# EAGLE design W5500_Tessel_mikroBUS_Click_005 (EAGLE 6.5.0)
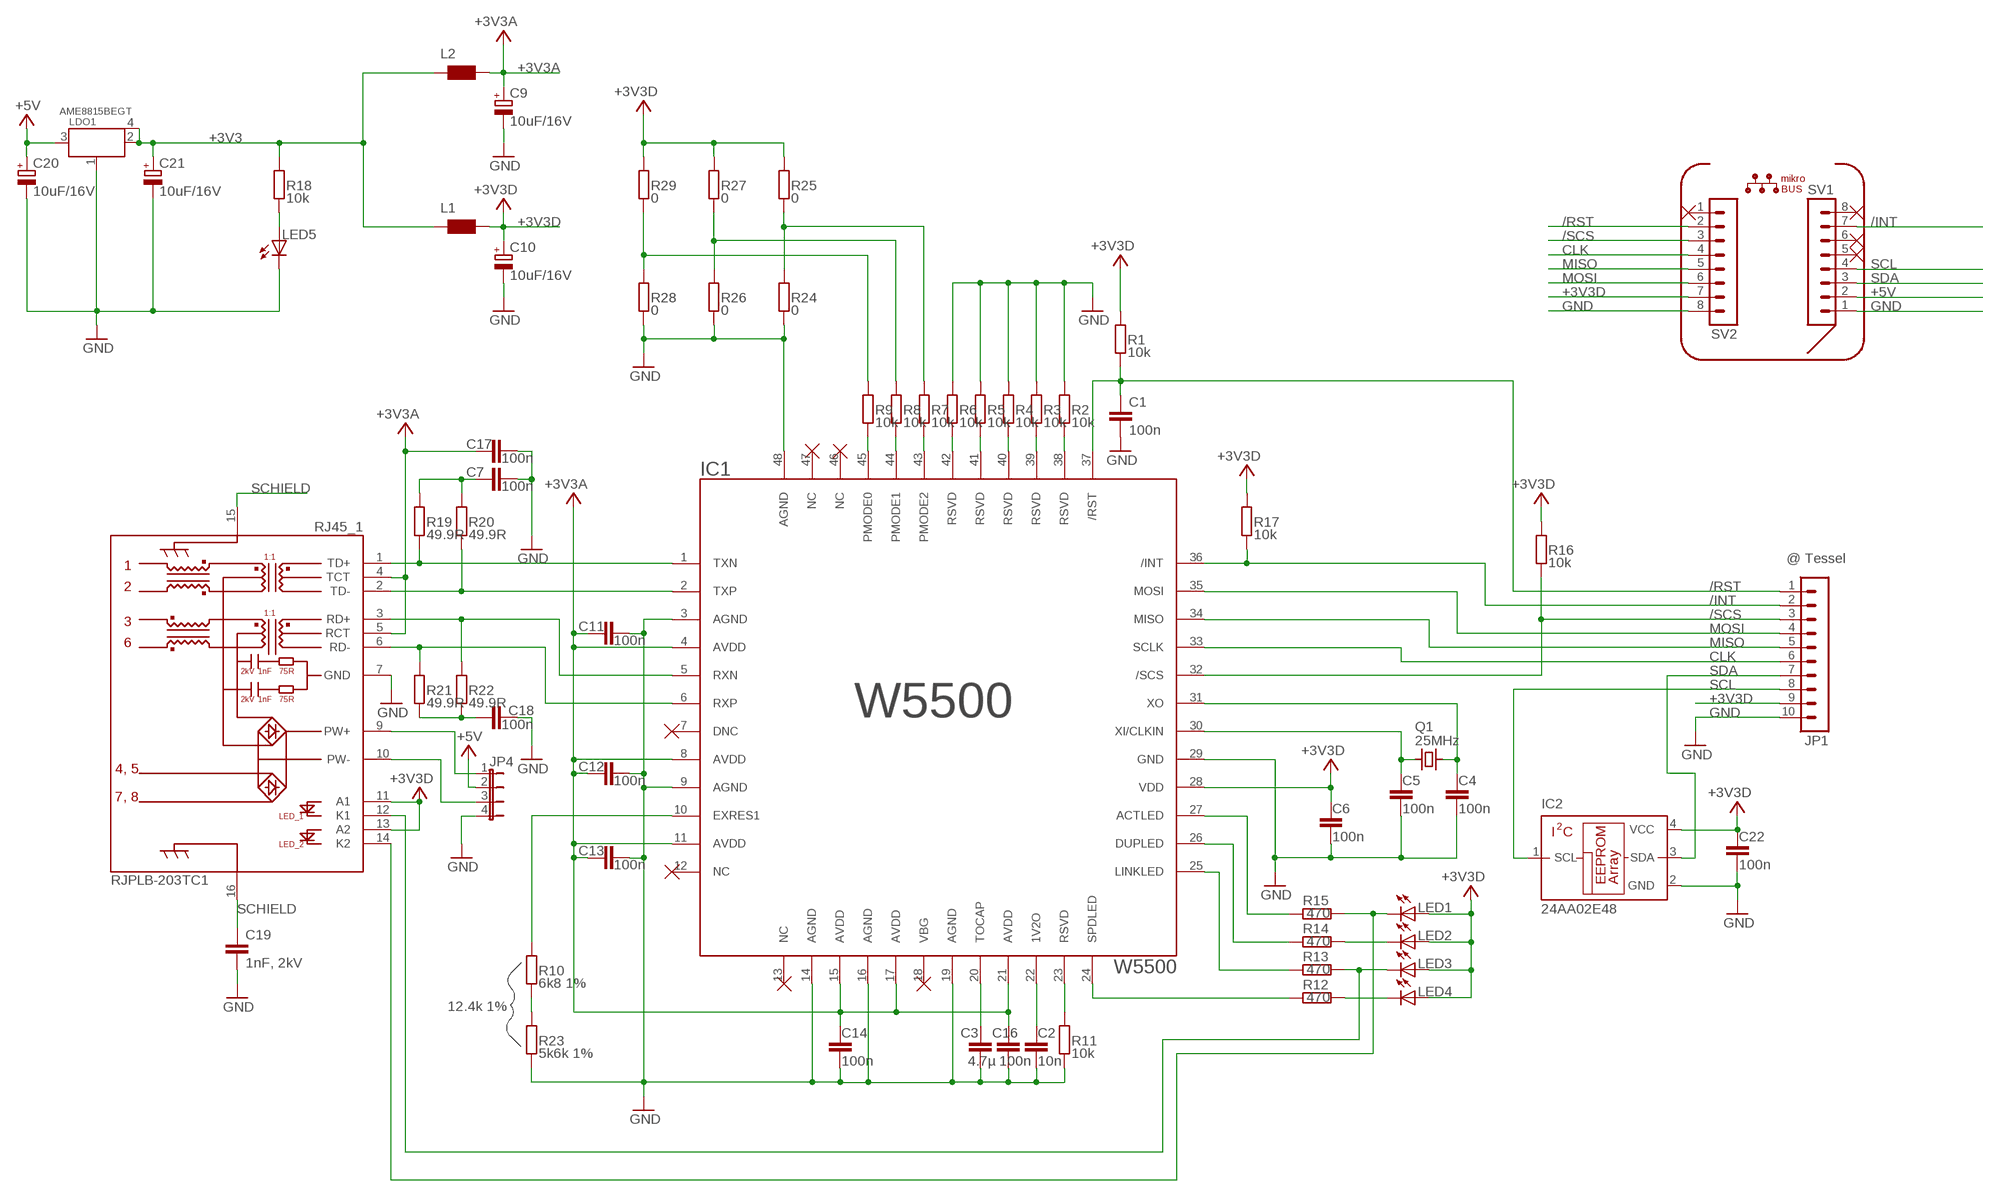
[diagram p0: schematic, sheet 1]

## Parts
C1  100n  C-EUC0603K  [C0603K]
C2  10n  C-EUC0402K  [C0402K]
C3  4.7µ  C-EUC0603K  [C0603K]
C4  100n  C-EUC0402K  [C0402K]
C5  100n  C-EUC0402K  [C0402K]
C6  100n  C-EUC0402K  [C0402K]
C7  100n  C-EUC0402K  [C0402K]
C9  10uF/16V  CPOL-EUA/3216-18R  [A/3216-18R]
C10  10uF/16V  CPOL-EUA/3216-18R  [A/3216-18R]
C11  100n  C-EUC0402K  [C0402K]
C12  100n  C-EUC0402K  [C0402K]
C13  100n  C-EUC0402K  [C0402K]
C14  100n  C-EUC0402K  [C0402K]
C16  100n  C-EUC0402K  [C0402K]
C17  100n  C-EUC0402K  [C0402K]
C18  100n  C-EUC0402K  [C0402K]
C19  1nF, 2kV  C-EUC3216  [C3216]
C20  10uF/16V  CPOL-EUA/3216-18R  [A/3216-18R]
C21  10uF/16V  CPOL-EUA/3216-18R  [A/3216-18R]
C22  100n  C-EUC0402K  [C0402K]
IC1  W5500  [LQFP48]
IC2  24AA02E48  24AA00OT  [SOT23-5L]
JP1  @ Tessel  MA10-1  [MA10-1]
JP4  JP4E  [JP4]
L1  WE-CBF_0603  [0603]
L2  WE-CBF_0603  [0603]
LDO1  AME8815BEGT  [SOT223]
LED1  LEDCHIPLED_0603  [CHIPLED_0603]
LED2  LEDCHIPLED_0603  [CHIPLED_0603]
LED3  LEDCHIPLED_0603  [CHIPLED_0603]
LED4  LEDCHIPLED_0603  [CHIPLED_0603]
LED5  LEDCHIPLED_0603  [CHIPLED_0603]
Q1  25MHz  SMD02502-4  [SMD02502-4]
R1  10k  R-EU_R0402  [R0402]
R2  10k  R-EU_R0402  [R0402]
R3  10k  R-EU_R0402  [R0402]
R4  10k  R-EU_R0402  [R0402]
R5  10k  R-EU_R0402  [R0402]
R6  10k  R-EU_R0402  [R0402]
R7  10k  R-EU_R0402  [R0402]
R8  10k  R-EU_R0402  [R0402]
R9  10k  R-EU_R0402  [R0402]
R10  6k8 1%  R-EU_R0402  [R0402]
R11  10k  R-EU_R0402  [R0402]
R12  470  R-EU_R0402  [R0402]
R13  470  R-EU_R0402  [R0402]
R14  470  R-EU_R0402  [R0402]
R15  470  R-EU_R0402  [R0402]
R16  10k  R-EU_R0402  [R0402]
R17  10k  R-EU_R0402  [R0402]
R18  10k  R-EU_R0402  [R0402]
R19  49.9R  R-EU_R0402  [R0402]
R20  49.9R  R-EU_R0402  [R0402]
R21  49.9R  R-EU_R0402  [R0402]
R22  49.9R  R-EU_R0402  [R0402]
R23  5k6k 1%  R-EU_R0402  [R0402]
R24  0  R-EU_R0402  [R0402]
R25  0  R-EU_R0402  [R0402]
R26  0  R-EU_R0402  [R0402]
R27  0  R-EU_R0402  [R0402]
R28  0  R-EU_R0402  [R0402]
R29  0  R-EU_R0402  [R0402]
RJ45_1  RJPLB-203TC1  [RJPLB-203]
SV1  MA08-1  [MA08-1]
SV2  MA08-1  [MA08-1]

## Nets
+3V3: C21.+ L1.2 L2.2 LDO1.2 LDO1.4 R18.2
+3V3A: C9.+ C11.1 C12.1 C13.1 C14.1 C16.1 C17.1 IC1.4(AVDD) IC1.8(AVDD) IC1.11(AVDD) IC1.15(AVDD) IC1.17(AVDD) IC1.21(AVDD) L2.1 RJ45_1.4(TCT) RJ45_1.5(RCT)
+3V3D: C6.1 C10.+ C22.1 IC1.28(VDD) IC2.4(VCC) JP1.9 L1.1 LED1.A LED2.A LED3.A LED4.A R1.2 R16.2 R17.2 R25.2 R27.2 R29.2 RJ45_1.11(A1) RJ45_1.13(A2) SV2.7
+5V: C20.+ JP4.2 LDO1.3 SV1.2
/INT: IC1.36(/INT) JP1.2 R17.1 SV1.7
/RST: C1.1 IC1.37(/RST) JP1.1 R1.1 SV2.2
/SCS: IC1.32(/SCS) JP1.3 R16.1 SV2.3
ACTLED: IC1.27(ACTLED) R15.1
CLK: IC1.33(SCLK) JP1.6 SV2.4
GND: C1.2 C2.2 C3.2 C4.2 C5.2 C6.2 C7.2 C9.- C10.- C11.2 C12.2 C13.2 C14.2 C16.2 C17.2 C18.2 C19.2 C20.- C21.- C22.2 IC1.3(AGND) IC1.9(AGND) IC1.14(AGND) IC1.16(AGND) IC1.19(AGND) IC1.29(GND) IC1.48(AGND) IC2.2(GND) JP1.10 JP4.4 LDO1.1 LED5.C R2.2 R3.2 R4.2 R5.2 R6.2 R11.1 R23.1 R24.1 R26.1 R28.1 RJ45_1.7(GND) SV1.1 SV2.8
MISO: IC1.34(MISO) JP1.5 SV2.5
MOSI: IC1.35(MOSI) JP1.4 SV2.6
N$4: IC1.25(LINKLED) R13.1
N$5: R10.1 R23.2
N$9: IC1.23(RSVD) R11.2
N$10: IC1.38(RSVD) R2.1
N$11: IC1.39(RSVD) R3.1
N$12: IC1.40(RSVD) R4.1
N$13: IC1.41(RSVD) R5.1
N$14: IC1.42(RSVD) R6.1
N$15: IC1.43(PMODE2) R7.1
N$16: IC1.44(PMODE1) R8.1
N$17: IC1.45(PMODE0) R9.1
N$18: R9.2 R28.2 R29.1
N$19: R8.2 R26.2 R27.1
N$20: R7.2 R24.2 R25.1
N$22: IC1.10(EXRES1) R10.2
N$23: C2.1 IC1.22(1V2O)
N$24: C3.1 IC1.20(TOCAP)
N$25: IC1.24(SPDLED) R12.1
N$26: IC1.26(DUPLED) R14.1
N$28: LED4.C R12.2
N$29: LED3.C R13.2 RJ45_1.12(K1)
N$30: LED2.C R14.2
N$31: LED1.C R15.2 RJ45_1.14(K2)
N$32: C4.1 IC1.31(XO) Q1.3
N$33: C5.1 IC1.30(XI/CLKIN) Q1.1
N$34: LED5.A R18.1
N$35: C7.1 R19.2 R20.2
N$36: C18.1 R21.1 R22.1
POE+: JP4.1 RJ45_1.9(PW+)
POE-: JP4.3 RJ45_1.10(PW-)
RXN: IC1.6(RXP) R21.2 RJ45_1.6(RD-)
RXP: IC1.5(RXN) R22.2 RJ45_1.3(RD+)
SCHIELD: C19.1 RJ45_1.15(SCHIELD_1) RJ45_1.16(SCHIELD_2)
SCL: IC2.1(SCL) JP1.8 SV1.4
SDA: IC2.3(SDA) JP1.7 SV1.3
TXN: IC1.2(TXP) R20.1 RJ45_1.2(TD-)
TXP: IC1.1(TXN) R19.1 RJ45_1.1(TD+)
Unconnected: IC1.7(DNC) IC1.12(NC) IC1.13(NC) IC1.18(VBG) IC1.46(NC) IC1.47(NC) SV1.5 SV1.6 SV1.8 SV2.1

## Notes on the sheet
- mikro
  BUS
- W5500
- 12.4k 1%

## Library data of the parts
C1-C7 C11-C14 C16-C19 C22 = resistor:C-EU: CAPACITOR, European symbol
C9 C10 C20 C21 = resistor:CPOL-EU: POLARIZED CAPACITOR, European symbol
IC1 = _wiznet_2013-08-18:W5500: W5500: WIZnet Hardwired TCP/IP + MAC + PHY - Internet Interface Chip
IC2 = microchip:24*00: Serial EEPROM 128 bit, I2C (AA = 1.8 V/LC = 2.5 V/C = 5.0 V); MF: MICROCHIP; MPN: 24AA00T-I/OTG; OC_FARNELL: 1331264; OC_NEWARK: 89H3038
JP1 = con-lstb:MA10-1: PIN HEADER; OC_FARNELL: unknown; OC_NEWARK: unknown
JP4 = jumper:JP4E: JUMPER
L1 L2 = wuerth-elektronik:WE-CBF: SMD EMI Suppression Ferrite Beads - excellent anti-EMI properties - low DCR - impedances till 3000 ohms - rated current up to 6 A
LDO1 = _wiznet_2013-08-18:AME8815BEGT
LED1-LED5 = led:LED: LED OSRAM: - CHIPLED LG R971, LG N971, LY N971, LG Q971, LY Q971, LO R971, LY R971 LH N974, LH R974 LS Q976, LO Q976, LY Q976 LO Q996 - Hyper CHIPLED LW Q18S LB Q993, LB Q99A, LB R99A - SideLED LS A670, LO A670, LY A670, LG A670, LP A670 LB A673, LV A673, LT A673, LW A673 LH A674 LY A675 LS A676, LA A676, LO A676, LY A676, LW A676 LS A679, LY A679, LG A679 - Hyper Micro SIDELED® LS Y876, LA Y876, LO Y876, LY Y876 LT Y87S - SmartLED LW L88C, LW L88S LB L89C, LB L89S, LG L890 LS L89K, LO L89K, LY L89K LS L896, LA L896, LO L896, LY L896 - TOPLED LS T670, LO T670, LY T670, LG T670, LP T670 LSG T670, LSP T670, LSY T670, LOP T670, LYG T670 LG T671, LOG T671, LSG T671 LB T673, LV T673, LT T673, LW T673 LH T674 LS T676, LA T676, LO T676, LY T676, LB T676, LH T676, LSB T676, LW T676 LB T67C, LV T67C, LT T67C, LS T67K, LO T67K, LY T67K, LW E67C LS E67B, LA E67B, LO E67B, LY E67B, LB E67C, LV E67C, LT E67C LW T67C LS T679, LY T679, LG T679 LS T770, LO T770, LY T770, LG T770, LP T770 LB T773, LV T773, LT T773, LW T773 LH T774 LS E675, LA E675, LY E675, LS T675 LS T776, LA T776, LO T776, LY T776, LB T776 LHGB T686 LT T68C, LB T68C - Hyper Mini TOPLED® LB M676 - Mini TOPLED Santana® LG M470 LS M47K, LO M47K, LY M47K Source: http://www.osram.convergy.de LUXEON: - LUMILED® LXK2-PW12-R00, LXK2-PW12-S00, LXK2-PW14-U00, LXK2-PW14-V00 LXK2-PM12-R00, LXK2-PM12-S00, LXK2-PM14-U00 LXK2-PE12-Q00, LXK2-PE12-R00, LXK2-PE12-S00, LXK2-PE14-T00, LXK2-PE14-U00 LXK2-PB12-K00, LXK2-PB12-L00, LXK2-PB12-M00, LXK2-PB14-N00, LXK2-PB14-P00, LXK2-PB14-Q00 LXK2-PR12-L00, LXK2-PR12-M00, LXK2-PR14-Q00, LXK2-PR14-R00 LXK2-PD12-Q00, LXK2-PD12-R00, LXK2-PD12-S00 LXK2-PH12-R00, LXK2-PH12-S00 LXK2-PL12-P00, LXK2-PL12-Q00, LXK2-PL12-R00 Source: www.luxeon.com KINGBRIGHT: KA-3528ASYC Source: www.kingbright.com
Q1 = Petermann_5_11_0:SMD02502-4
R1-R29 = resistor:R-EU_: RESISTOR, European symbol
RJ45_1 = Taimag:RJPLB-203TC1
SV1 SV2 = con-lstb:MA08-1: PIN HEADER; OC_FARNELL: unknown; OC_NEWARK: unknown

## Board
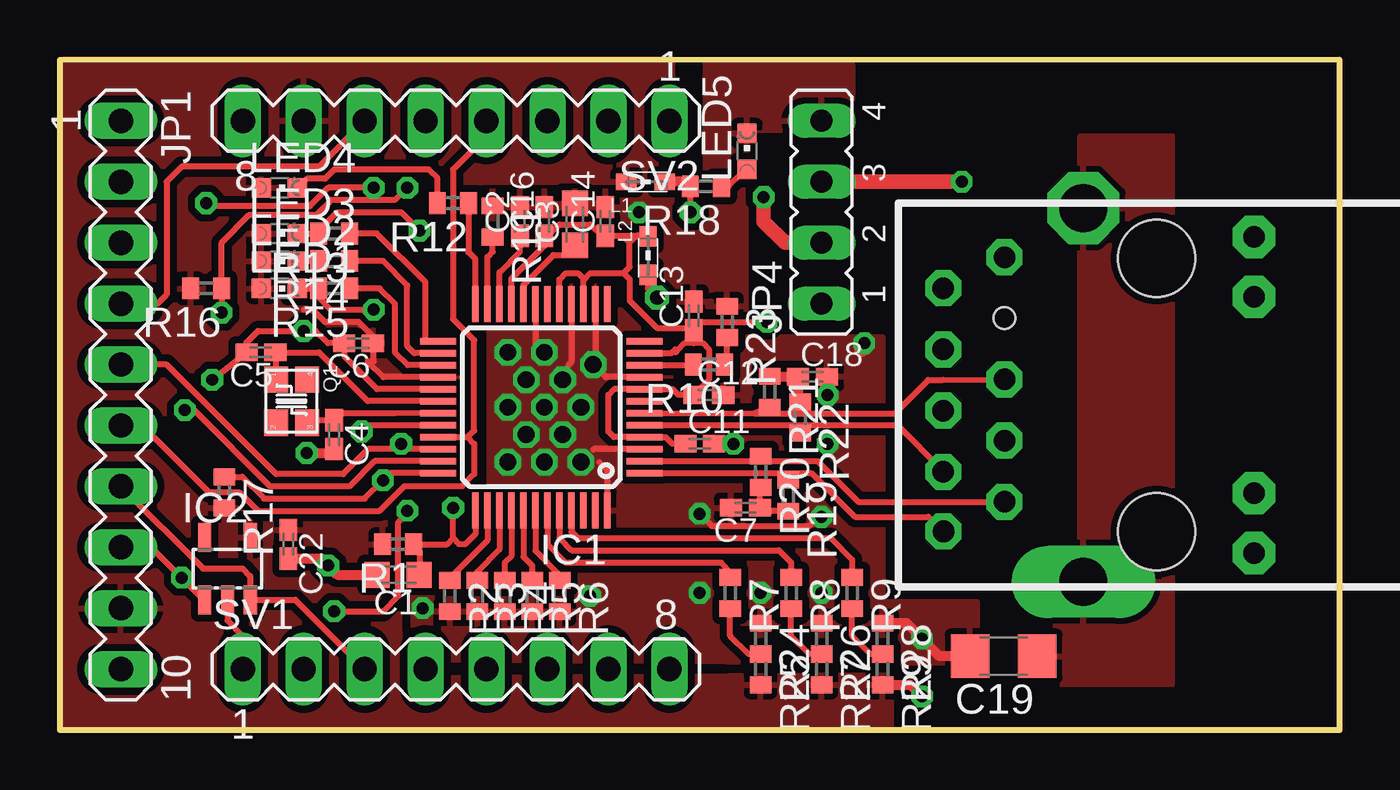
[diagram p1: board, top side]
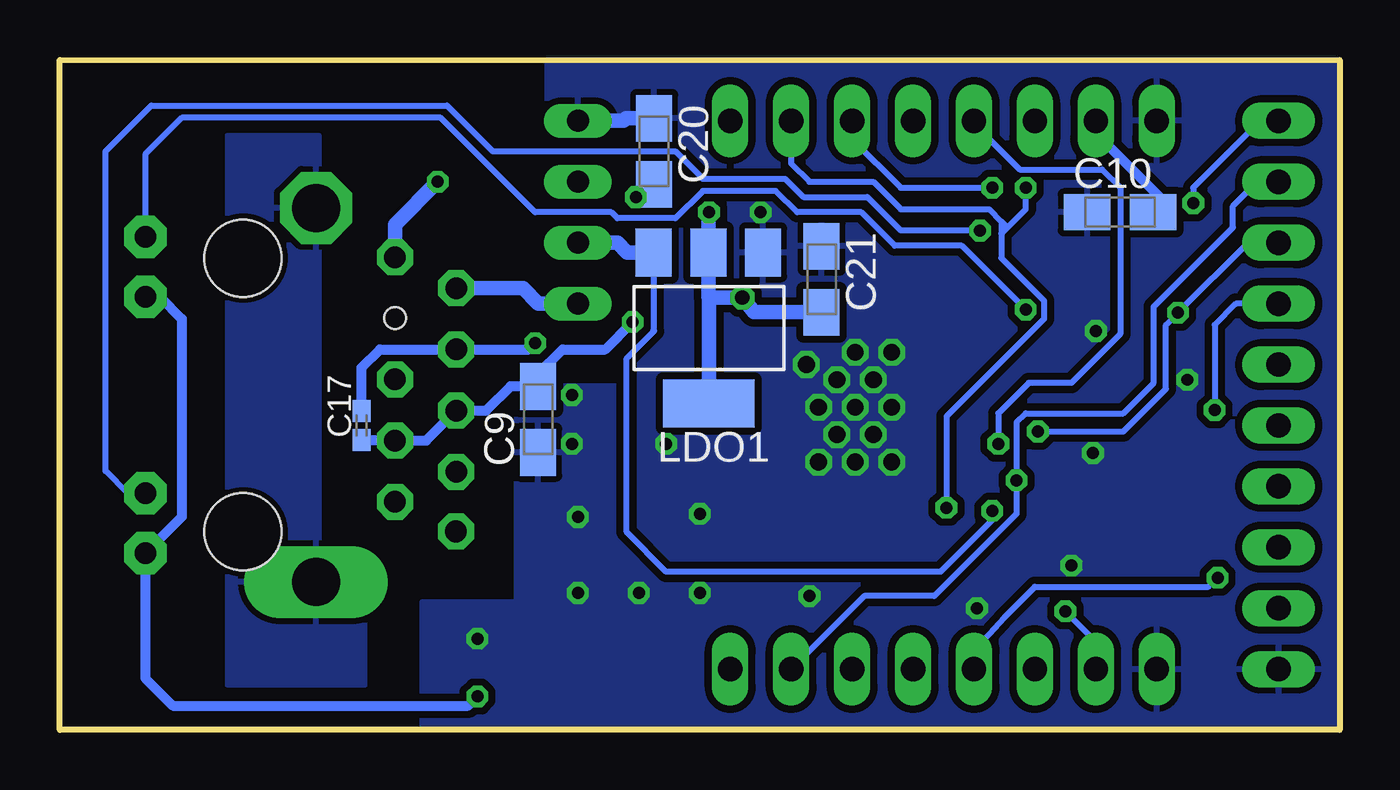
[diagram p2: board, bottom side, seen from below]

Size 53.34 x 27.94 mm. Coordinates in mm from the lower left corner, seen from the top.
Outline: 0,0 53.34,0 53.34,27.94 0,27.93 0,0
Copper layers (1*16): Top 0.035mm / dielectric 1.5mm / Bottom 0.035mm
Design rules "default *": minimum track width 10mil, minimum drill 24mil, track to track 8mil, track to pad 8mil, pad to pad 8mil, via to via 8mil, smd to smd 8mil, copper to edge 0mil, drill to drill 8mil, minimum pad ring 10mil, minimum via ring 8mil, stop-mask expansion 4mil, vias tented up to drill 0mil, thermal gap 10mil

### Footprints (pad centres in the part's own frame; a part is rotated, then mirrored left to right if it is on the bottom)
C0603K = smd 1.05 x 1.08: 1 -0.875,0; 2 0.875,0
C0402K = smd 0.925 x 0.74: 1 -0.6,0; 2 0.6,0
A/3216-18R = smd 1.95 x 1.5: + 1.375,0; - -1.375,0
C3216 = smd 1.6 x 1.8: 1 -1.4,0; 2 1.4,0
LQFP48 = smd 1.5 x 0.28: 1 -4.3,2.75; 2 -4.3,2.25; 3 -4.3,1.75; 4 -4.3,1.25; 5 -4.3,0.75; 6 -4.3,0.25; 7 -4.3,-0.25; 8 -4.3,-0.75; 9 -4.3,-1.25; 10 -4.3,-1.75; 11 -4.3,-2.25; 12 -4.3,-2.75; 25 4.3,-2.75; 26 4.3,-2.25; 27 4.3,-1.75; 28 4.3,-1.25; 29 4.3,-0.75; 30 4.3,-0.25; 31 4.3,0.25; 32 4.3,0.75; 33 4.3,1.25; 34 4.3,1.75; 35 4.3,2.25; 36 4.3,2.75 | smd 0.28 x 1.5: 13 -2.75,-4.3; 14 -2.25,-4.3; 15 -1.75,-4.3; 16 -1.25,-4.3; 17 -0.75,-4.3; 18 -0.25,-4.3; 19 0.25,-4.3; 20 0.75,-4.3; 21 1.25,-4.3; 22 1.75,-4.3; 23 2.25,-4.3; 24 2.75,-4.3; 37 2.75,4.3; 38 2.25,4.3; 39 1.75,4.3; 40 1.25,4.3; 41 0.75,4.3; 42 0.25,4.3; 43 -0.25,4.3; 44 -0.75,4.3; 45 -1.25,4.3; 46 -1.75,4.3; 47 -2.25,4.3; 48 -2.75,4.3
SOT23-5L = smd 0.55 x 1.2: 1 -0.95,-1.3; 2 0,-1.3; 3 0.95,-1.3; 4 0.95,1.3; 5 -0.95,1.3
MA10-1 = drill 1.016 long: 1 -11.43,0; 2 -8.89,0; 3 -6.35,0; 4 -3.81,0; 5 -1.27,0; 6 1.27,0; 7 3.81,0; 8 6.35,0; 9 8.89,0; 10 11.43,0
JP4 = drill 0.914 long: 1 -3.81,0; 2 -1.27,0; 3 1.27,0; 4 3.81,0
0603 = smd 0.85 x 0.7: 1 -0.9,0; 2 0.7,0
SOT223 = smd 1.499 x 2.007: 1 -2.261,-3.15; 2 0.025,-3.15; 3 2.311,-3.15 | smd 3.81 x 2.007: 4 0,3.15
CHIPLED_0603 = smd 0.8 x 0.8: A 0,-0.75; C 0,0.75
SMD02502-4 = smd 1.1 x 1: 1 -0.9,-0.65; 2 0.9,-0.65; 3 0.9,0.65; 4 -0.9,0.65
R0402 = smd 0.7 x 0.9: 1 -0.65,0; 2 0.65,0
RJPLB-203 = drill 0.9 pad 1.5 octagon: 1 -5.69,8.888; 2 -4.45,6.348; 3 -3.2,8.898; 4 -1.9,6.348; 5 -0.65,8.898; 6 0.65,6.348; 7 1.9,8.898; 9 4.45,8.898; 10 5.74,6.348 | drill 0.9 pad 1.778 octagon: 11 -6.6,-4.062; 12 -4.1,-4.062; 13 4.1,-4.062; 14 6.6,-4.062 | drill 2 pad 2.2 long: 15 -7.8,3.058 | drill 2 pad 3 octagon: 16 7.8,3.058 | hole 3.2: 5.7,0.008; -5.7,0.008 | hole 0.9: 3.2,6.35
MA08-1 = drill 1.016 long: 1 -8.89,0; 2 -6.35,0; 3 -3.81,0; 4 -1.27,0; 5 1.27,0; 6 3.81,0; 7 6.35,0; 8 8.89,0

### Placement (x,y rotation side)
C1  14.1,6.48 180 top
C2  19.18,21.21 90 top
C3  21.46,21.08 90 top
C4  11.43,12.32 270 top
C5  8.38,15.75 180 top
C6  12.45,16.13 180 top
C7  28.58,9.27 180 top
C9  33.4,12.95 90 bottom
C10  9.14,21.59 0 bottom
C11  26.67,11.94 0 top
C12  27.05,13.97 0 top
C13  26.42,17.27 90 top
C14  22.73,21.21 90 top
C16  20.19,21.21 90 top
C17  40.77,12.7 90 bottom
C18  31.37,14.73 0 top
C19  39.34,3.08 180 top
C20  28.57,24.13 270 bottom
C21  21.59,18.8 270 bottom
C22  9.53,7.75 270 top
IC1  20.07,13.46 180 top
IC2  6.99,6.73 0 top
JP1  2.54,13.97 270 top
JP4  31.75,21.59 90 top
L1  24.51,22.86 0 top
L2  24.51,19.68 270 top
LDO1  26.29,16.76 180 bottom
LED1  9.14,18.41 270 top
LED2  9.14,19.56 270 top
LED3  9.14,20.7 270 top
LED4  9.14,22.61 270 top
LED5  28.64,24.13 0 top
Q1  9.65,13.72 270 top
R1  14.1,7.75 180 top
R2  16.26,5.59 270 top
R3  17.4,5.59 270 top
R4  18.54,5.59 270 top
R5  19.68,5.59 270 top
R6  20.83,5.59 270 top
R7  27.94,5.71 270 top
R8  30.48,5.71 270 top
R9  33.02,5.71 270 top
R10  27.05,15.24 180 top
R11  18.03,21.21 270 top
R12  16.38,21.97 180 top
R13  11.43,20.7 180 top
R14  11.43,19.56 180 top
R15  11.43,18.41 180 top
R16  6.1,18.41 180 top
R17  6.86,9.91 270 top
R18  26.92,22.67 180 top
R19  30.35,9.78 270 top
R20  29.21,10.77 270 top
R21  29.59,14.1 270 top
R22  30.86,13.03 270 top
R23  27.81,17.02 270 top
R24  29.21,3.81 270 top
R25  29.21,2.54 270 top
R26  31.75,3.81 270 top
R27  31.75,2.54 270 top
R28  34.29,3.81 270 top
R29  34.29,2.54 270 top
RJ45_1  45.72,13.97 90 top
SV1  16.51,2.54 0 top
SV2  16.51,25.4 180 top

### Tracks (layer width: path | path; a pad name or v marks a point on that pad's centre or on a via)
+3V3  (via drill 0.5, 0.6)
  Top 0.254: L2.2 24.51,18.41 v24.89,18.03 | R18.2 26.27,21.61 v26.29,21.59
  Top 0.406: R18.2 26.08,22.86 L1.2
  Bottom 0.61: 26.29,18.03 26.31,18.06 LDO1.2 26.31,21.57 v26.29,21.59 | LDO1.4 26.29,18.03 | 26.29,18.03 v24.89,18.03 24.41,17.42 C21.+
+3V3A  (via drill 0.5)
  Top 0.254: IC1.21 18.82,18.82 20.19,20.19 C16.1 20.36,20.61 20.83,21.08 22.1,21.08 22.23,20.95 22.64,20.57 C14.1 24.04,20.61 | C11.1 25.53,11.94 25.25,12.21 IC1.4 23.09,12.21 22.86,12.45 22.86,13.97 23.1,14.21 IC1.8 25.54,14.21 25.78,13.97 C12.1 26.45,14.01 27.05,14.61 27.05,15.88 26.8,16.13 26.42,16.13 | IC1.17 20.82,18.78 21.08,19.05 21.59,19.05 21.82,18.82 IC1.15 21.82,18.77 22.1,19.05 23.5,19.05 | C13.1 26.42,16.13 | IC1.11 25.49,15.71 25.65,15.88 25.72,15.81 | 26.42,16.13 26.04,16.13 25.72,15.81 | 25.72,15.81 25.65,15.75 | C13.1 26.42,16.89 26.54,16.89 26.67,17.02 v29.46,17.02 | L2.1 24.49,20.61 24.04,20.61 | 23.5,19.05 23.75,18.8 23.75,17.91 24.89,16.76 26.32,16.76 C13.1 | 23.5,19.05 23.75,19.3 23.75,20.32 | 23.75,20.32 23.5,20.57 24,20.57 | 24,20.57 23.75,20.32 | 24.04,20.61 24,20.57
  Bottom 0.406: C17.1 40.74,12.07 RJ45_1.4 38.07,12.07 RJ45_1.5 35.58,13.32 34.57,14.33 C9.+ 33.4,14.86 32.38,15.88 30.61,15.88 v29.46,17.02
+3V3D  (via drill 0.5)
  Top 0.254: 13.08,16.26 13.08,16.38 12.45,17.02 11.05,17.02 10.54,17.53 10.16,17.53 | IC1.28 13.48,14.71 12.83,15.37 13.08,15.37 13.08,16.09 C6.1
  Top 0.406: v35.94,1.4 35.45,1.89 R29.2
  Bottom 0.406: RJ45_1.13 49.19,18.07 48.26,17.14 48.26,8.89 RJ45_1.11 49.78,2.16 48.64,1.02 36.32,1.02 v35.94,1.4 | C10.+ 7.13,21.87 10.16,24.89 | 10.16,24.89 10.16,24.87 | 10.16,24.89 SV2.7
  pour Top (isolate 0.305): 0.13,27.94 0,0 34.67,0 34.67,2.29 14.22,2.16 14.1,6.86 17.4,6.86 17.4,6.86 17.53,22.86 25.53,22.86 25.53,27.94
+5V  (via drill 0.5)
  Top 0.254: v11.43,4.95 13.46,4.95 14.1,5.59 14.1,8.64 v14.48,9.14
  Top 0.61: v29.34,22.23 29.34,21.21 30.23,20.32 JP4.2
  Bottom 0.254: SV1.2 10.16,3.68 v11.43,4.95 | v14.48,9.14 14.48,8.76 16.64,6.6 28.07,6.6 29.72,8.26 29.72,15.49 28.57,16.64 28.6,16.66 LDO1.3
  Bottom 0.61: JP4.2 30.1,20.32 29.69,19.91 LDO1.3 | C20.+ 28.81,22.75 v29.34,22.23
/INT  (via drill 0.5 pad 0.25)
  Top 0.254: IC1.36 13.76,10.71 v13.46,10.41 12.7,9.65 8.51,9.65 7.61,10.56 R17.1
  Bottom 0.254: SV1.7 19.81,5.59 16.89,5.59 13.46,9.02 v13.46,10.41 13.46,12.83 13.08,13.21 9.02,13.21 7.75,14.48 7.75,17.65 4.45,20.95 4.45,21.84 3.43,22.86 JP1.2
/RST  (via drill 0.5)
  Top 0.254: C1.1 15,7.46 R1.1 16.13,7.75 16.38,8 | IC1.37 17.32,8.17 16.89,7.75 16.64,7.75 16.38,8 | 16.38,8 v16.38,9.27 | v13.08,22.61 11.18,22.61 10.41,21.84 6.22,21.84 v6.1,21.97
  Bottom 0.254: SV2.2 22.86,23.62 22.1,22.86 19.43,22.86 18.29,21.72 14.61,21.72 14.1,21.21 | 14.1,21.21 14.1,20.7 | 14.1,20.7 14.1,19.68 12.32,17.91 12.32,17.14 16.38,13.08 v16.38,9.27 | 14.1,21.21 13.84,20.95 | 14.1,20.7 13.84,20.95 | 13.84,20.95 13.08,21.72 v13.08,22.61 | JP1.1 3.3,25.4 6.1,22.61 v6.1,21.97
/SCS  (via drill 0.5 pad 0.25)
  Top 0.254: v12.57,12.45 12.84,12.71 IC1.32 | v14.48,22.61 13.97,22.1 11.3,22.1 10.67,21.46 7.87,21.46 6.75,20.34 R16.1 v6.73,17.4
  Bottom 0.254: SV2.3 20.32,24.64 18.29,22.61 v14.48,22.61 | v12.57,12.45 9.02,12.45 7.24,14.22 7.24,16.89 v6.73,17.4 3.81,20.32 JP1.3
ACTLED
  Top 0.254: IC1.27 14.51,15.21 13.97,15.75 13.97,17.78 13.34,18.41 R15.1
CLK
  Top 0.254: IC1.33 17,12.21 | 17,12.21 17.27,11.94 17.27,10.67 16.76,10.16 14.35,10.16 13.34,9.14 8.26,9.14 7.49,9.91 6.22,9.91 3.43,12.7 JP1.6 | 17,12.21 17.27,12.49 17.27,16.26 16.38,17.14 16.38,23.37 17.78,24.77 SV2.4
GND  (via drill 0.5, 0.7)
  Top 0.254: IC2.2 6.99,4.57 7.62,3.94 SV1.1 | IC1.29 13.22,14.21 11.85,15.59 C6.2 11.18,16.13 10.67,16.64 v10.16,16.64 8.26,16.64 7.78,16.16 C5.2 v6.35,14.61 | IC1.19 19.82,16.01 19.81,16 | IC1.16 21.32,15.35 21.21,15.24 | IC1.14 22.32,15.15 22.75,14.71 IC1.9 | IC1.3 22.25,11.71 22.23,11.68 | IC1.48 22.82,10.84 22.48,11.18 | C11.2 v28.07,11.94 | v26.67,9.02 27.18,8.51 31.24,8.51 31.75,9.02
  Top 0.406: v10.29,11.56 11.27,11.56 C4.2 | C19.2 36.67,3.08 v35.94,3.81 35.29,4.46 R28.1 | C22.2 10.89,7.15 v11.18,6.86 11.56,6.48 13.09,6.48 C1.2
  Top 0.61: 33.41,15.87 33.4,15.88
  Bottom 0.406: C17.2 40.77,15.11 40.01,15.88 RJ45_1.7 | RJ45_1.7 | RJ45_1.7 33.78,15.88 v33.53,16.13
  Bottom 0.61: C20.- 29.74,25.5 29.84,25.4 JP4.4
  other vias: 24.13,21.59 18.67,15.75 20.19,15.75 22.23,15.24 20.95,14.61 19.43,14.61 21.72,13.46 20.19,13.46 18.67,13.46 20.95,12.32 19.43,12.32 21.72,11.18 20.19,11.18 18.67,11.18 29.21,5.71 31.75,5.71 32,13.97 32,11.94 22.1,5.59 26.67,5.71 31.75,8.89 15.11,5.08
  pour Bottom (isolate 0.305): 0,0 38.23,0 38.23,5.33 34.29,5.33 34.29,14.35 34.29,14.35 29.46,14.35 29.46,14.35 29.46,25.4 33.02,25.4 33.02,27.94 0,27.94
  pour Top (isolate 0.305): 14.73,2.92 14.73,6.73 17.91,6.6 17.91,22.48 26.92,22.48 26.92,27.94 33.02,27.94 33.02,25.02 28.57,25.02 28.57,25.02 28.57,16.38 34.29,16.38 34.29,5.33 38.23,5.33 38.23,2.79 34.29,2.79
MISO  (via drill 0.5 pad 0.25)
  Top 0.254: 14,11.71 13.97,11.71 | 13.97,11.71 12.86,11.71 11.81,10.67 9.02,10.67 4.45,15.24 JP1.5 | IC1.34 14.45,11.71 v14.22,11.94 13.97,11.71
  Bottom 0.254: v14.22,11.94 14.22,13.21 12.95,14.48 11.18,14.48 9.14,16.51 9.14,22.61 9.91,23.37 13.34,23.37 15.24,25.27 SV2.5
MOSI  (via drill 0.5 pad 0.25)
  Top 0.254: IC1.35 13.12,11.21 12.06,10.16 8.76,10.16 5.59,13.34 v5.21,13.34 | SV2.6 10.79,23.5 5.08,23.5 4.45,22.86 4.45,18.16 4.06,17.78 JP1.4
  Bottom 0.254: JP1.4 4.32,17.78 5.21,16.89 v5.21,13.34
N$4
  Top 0.254: IC1.25 15.24,16.21 15.24,18.67 13.21,20.7 R13.1
N$5
  Top 0.254: R10.1 27.81,15.35 R23.2
N$9
  Top 0.254: IC1.23 17.82,19.72 18.03,19.94 R11.2
N$10
  Top 0.254: IC1.38 17.82,7.91 16.26,6.35 R2.1
N$11
  Top 0.254: IC1.39 18.32,7.52 17.4,6.6 R3.1
N$12
  Top 0.254: IC1.40 18.82,7.26 18.54,6.99 R4.1
N$13
  Top 0.254: IC1.41 19.32,7.23 19.68,6.86 R5.1
N$14
  Top 0.254: IC1.42 19.82,7.49 20.83,6.48 R6.1
N$15
  Top 0.254: IC1.43 20.32,7.75 21.08,6.99 27.56,6.99 27.94,6.6 R7.1
N$16
  Top 0.254: IC1.44 20.82,8.01 21.34,7.49 29.97,7.49 30.48,6.99 R8.1
N$17
  Top 0.254: IC1.45 21.32,8.28 21.59,8 32.13,8 33.02,7.11 R9.1
N$18
  Top 0.254: 33.78,3.17 33.02,3.94 R9.2 | 33.78,3.19 33.78,3.17 | 33.78,3.17 34.27,3.17 R28.2 R29.1
N$19
  Top 0.254: R8.2 30.48,3.94 31.24,3.17 31.24,3.16 R27.1 R26.2
N$20
  Top 0.254: 28.7,3.17 27.94,3.94 R7.2 | 28.7,3.19 28.7,3.17 | R24.2 R25.1 29.2,3.17 28.7,3.17
N$22
  Top 0.254: IC1.10 26.3,15.21 R10.2
N$23
  Top 0.254: IC1.22 18.32,19.08 19.18,19.94 C2.1
N$24
  Top 0.254: IC1.20 19.32,18.55 20.57,19.81 21.04,19.81 C3.1
N$25
  Top 0.254: IC1.24 17.32,19.64 17.03,19.92 R12.1
N$26
  Top 0.254: IC1.26 14.77,15.71 14.48,16 14.48,18.54 13.46,19.56 R14.1
N$28
  Top 0.254: LED4.C 10.29,22.99 11.05,22.99 11.43,23.37 15.37,23.37 15.73,23 R12.2
N$29  (via drill 0.5)
  Top 0.254: LED3.C R13.2 10.91,20.94 11.56,21.59 14.22,21.59 v14.99,20.83
  Bottom 0.254: RJ45_1.12 50.51,9.87 51.44,10.79 51.44,24.13 49.53,26.04 37.21,26.04 35.31,24.13 27.69,24.13 26.54,22.99 23.11,22.99 22.35,22.23 19.68,22.23 18.29,20.83 v14.99,20.83
N$30
  Top 0.254: R14.2 LED2.C
N$31  (via drill 0.5 pad 0.25)
  Top 0.254: LED1.C R15.2 10.79,18.4 10.79,18.03 11.29,17.54 v13.08,17.53
  Bottom 0.254: v13.08,17.53 15.75,20.19 18.54,20.19 19.94,21.59 22.61,21.59 23.5,22.48 26.54,22.48 27.69,21.34 30.1,21.34 30.35,21.59 33.53,21.59 37.47,25.53 48.26,25.53 49.78,24 RJ45_1.14
N$32
  Top 0.254: IC1.31 15.75,13.21 13.97,13.21 11.65,13.21 C4.1 10.53,12.92 Q1.3
N$33
  Top 0.254: IC1.30 12.83,13.71 10.79,15.75 C5.1 9,15.73 Q1.1
N$34
  Top 0.254: R18.1 27.88,22.67 28.45,23.24 LED5.A
N$35
  Top 0.254: R19.2 29.7,9.13 C7.1 29.18,10.03 R20.2
N$36
  Top 0.406: R21.1 30.75,14.75 C18.1 30.77,13.77 R22.1
POE+
  Bottom 0.61: RJ45_1.9 34.04,18.42 33.4,17.78 JP4.1
POE-  (via drill 0.5)
  Top 0.61: v37.59,22.86 JP4.3
  Bottom 0.61: RJ45_1.10 39.37,21.08 v37.59,22.86
RXN
  Top 0.254: IC1.6 30.35,13.21 | 30.35,13.21 30.73,13.21 34.8,13.21 36.2,14.61 36.82,14.61 RJ45_1.6 | R21.2 28.96,13.21 30.35,13.21
RXP
  Top 0.254: IC1.5 30.86,12.71 | 30.86,12.71 34.91,12.71 36.85,10.77 RJ45_1.3 | R22.2 30.86,12.71
SCHIELD
  pour Bottom (isolate 0.254): 46.35,24.77 46.35,1.91 40.64,1.91 40.64,6.35 42.55,6.35 42.55,24.77
  pour Top (isolate 0.305): 46.35,24.77 46.35,1.91 41.15,1.91 41.15,6.35 42.55,6.35 42.55,24.77
SCL  (via drill 0.5 pad 0.25)
  Top 0.254: JP1.8 3.81,7.62 v5.08,6.35 | v5.08,6.35 6,5.43 IC2.1 5.5,5.97 v5.08,6.35
  Bottom 0.254: SV1.4 15.24,3.3 13.97,4.7 12.7,5.97 5.46,5.97 v5.08,6.35
SDA
  Top 0.254: JP1.7 5.97,6.73 7.62,6.73 7.93,6.42 IC2.3 9.81,5.43 SV1.3
TXN
  Top 0.254: IC1.2 28.96,11.21 | 28.96,11.21 31.59,11.21 33.28,9.52 RJ45_1.2 | R20.1 28.96,11.21
TXP
  Top 0.254: IC1.1 30.73,10.71 | 30.73,10.71 31.32,10.71 33.15,8.89 36.2,8.89 36.8,8.28 RJ45_1.1 | R19.1 30.73,10.71

### Text on the board
Document: GND | +3V3 | MOSI | MISO | CLK | /SCS | /RST | nc. (AN) | GND | +5V | SDA | SCL | nc. (TX) | nc. (RX) | /INT | nc. (PWM)
tDocu: W5500 - Tessel Module, see: http://www.technical.io/ | W5500 - Espruino Module, see: http://www.espruino.com/ | W5500 - mikroBUS(TM) Module, see: http://www.mikroe.com | mikro | BUS | Tessel | Espruino | GND | G3 (RST) | PoE- | GPIOs | Ethernet / + PoE | G2 (INT) | G1 (SCS) | +5V | PoE out | MOSI | PoE+ | SPI | MISO | CLK | SDA | I²C | SCL | 3V3 | Power | GND